# EasyEDA schematic schematic.json
TITLE: Sensor Pin Connector; REV: 1.0; Date: 2024-11-30; Sheet: 1/1; Drawn By: Jack Ruder; Company: Athenaeum Stade - AtheBlues
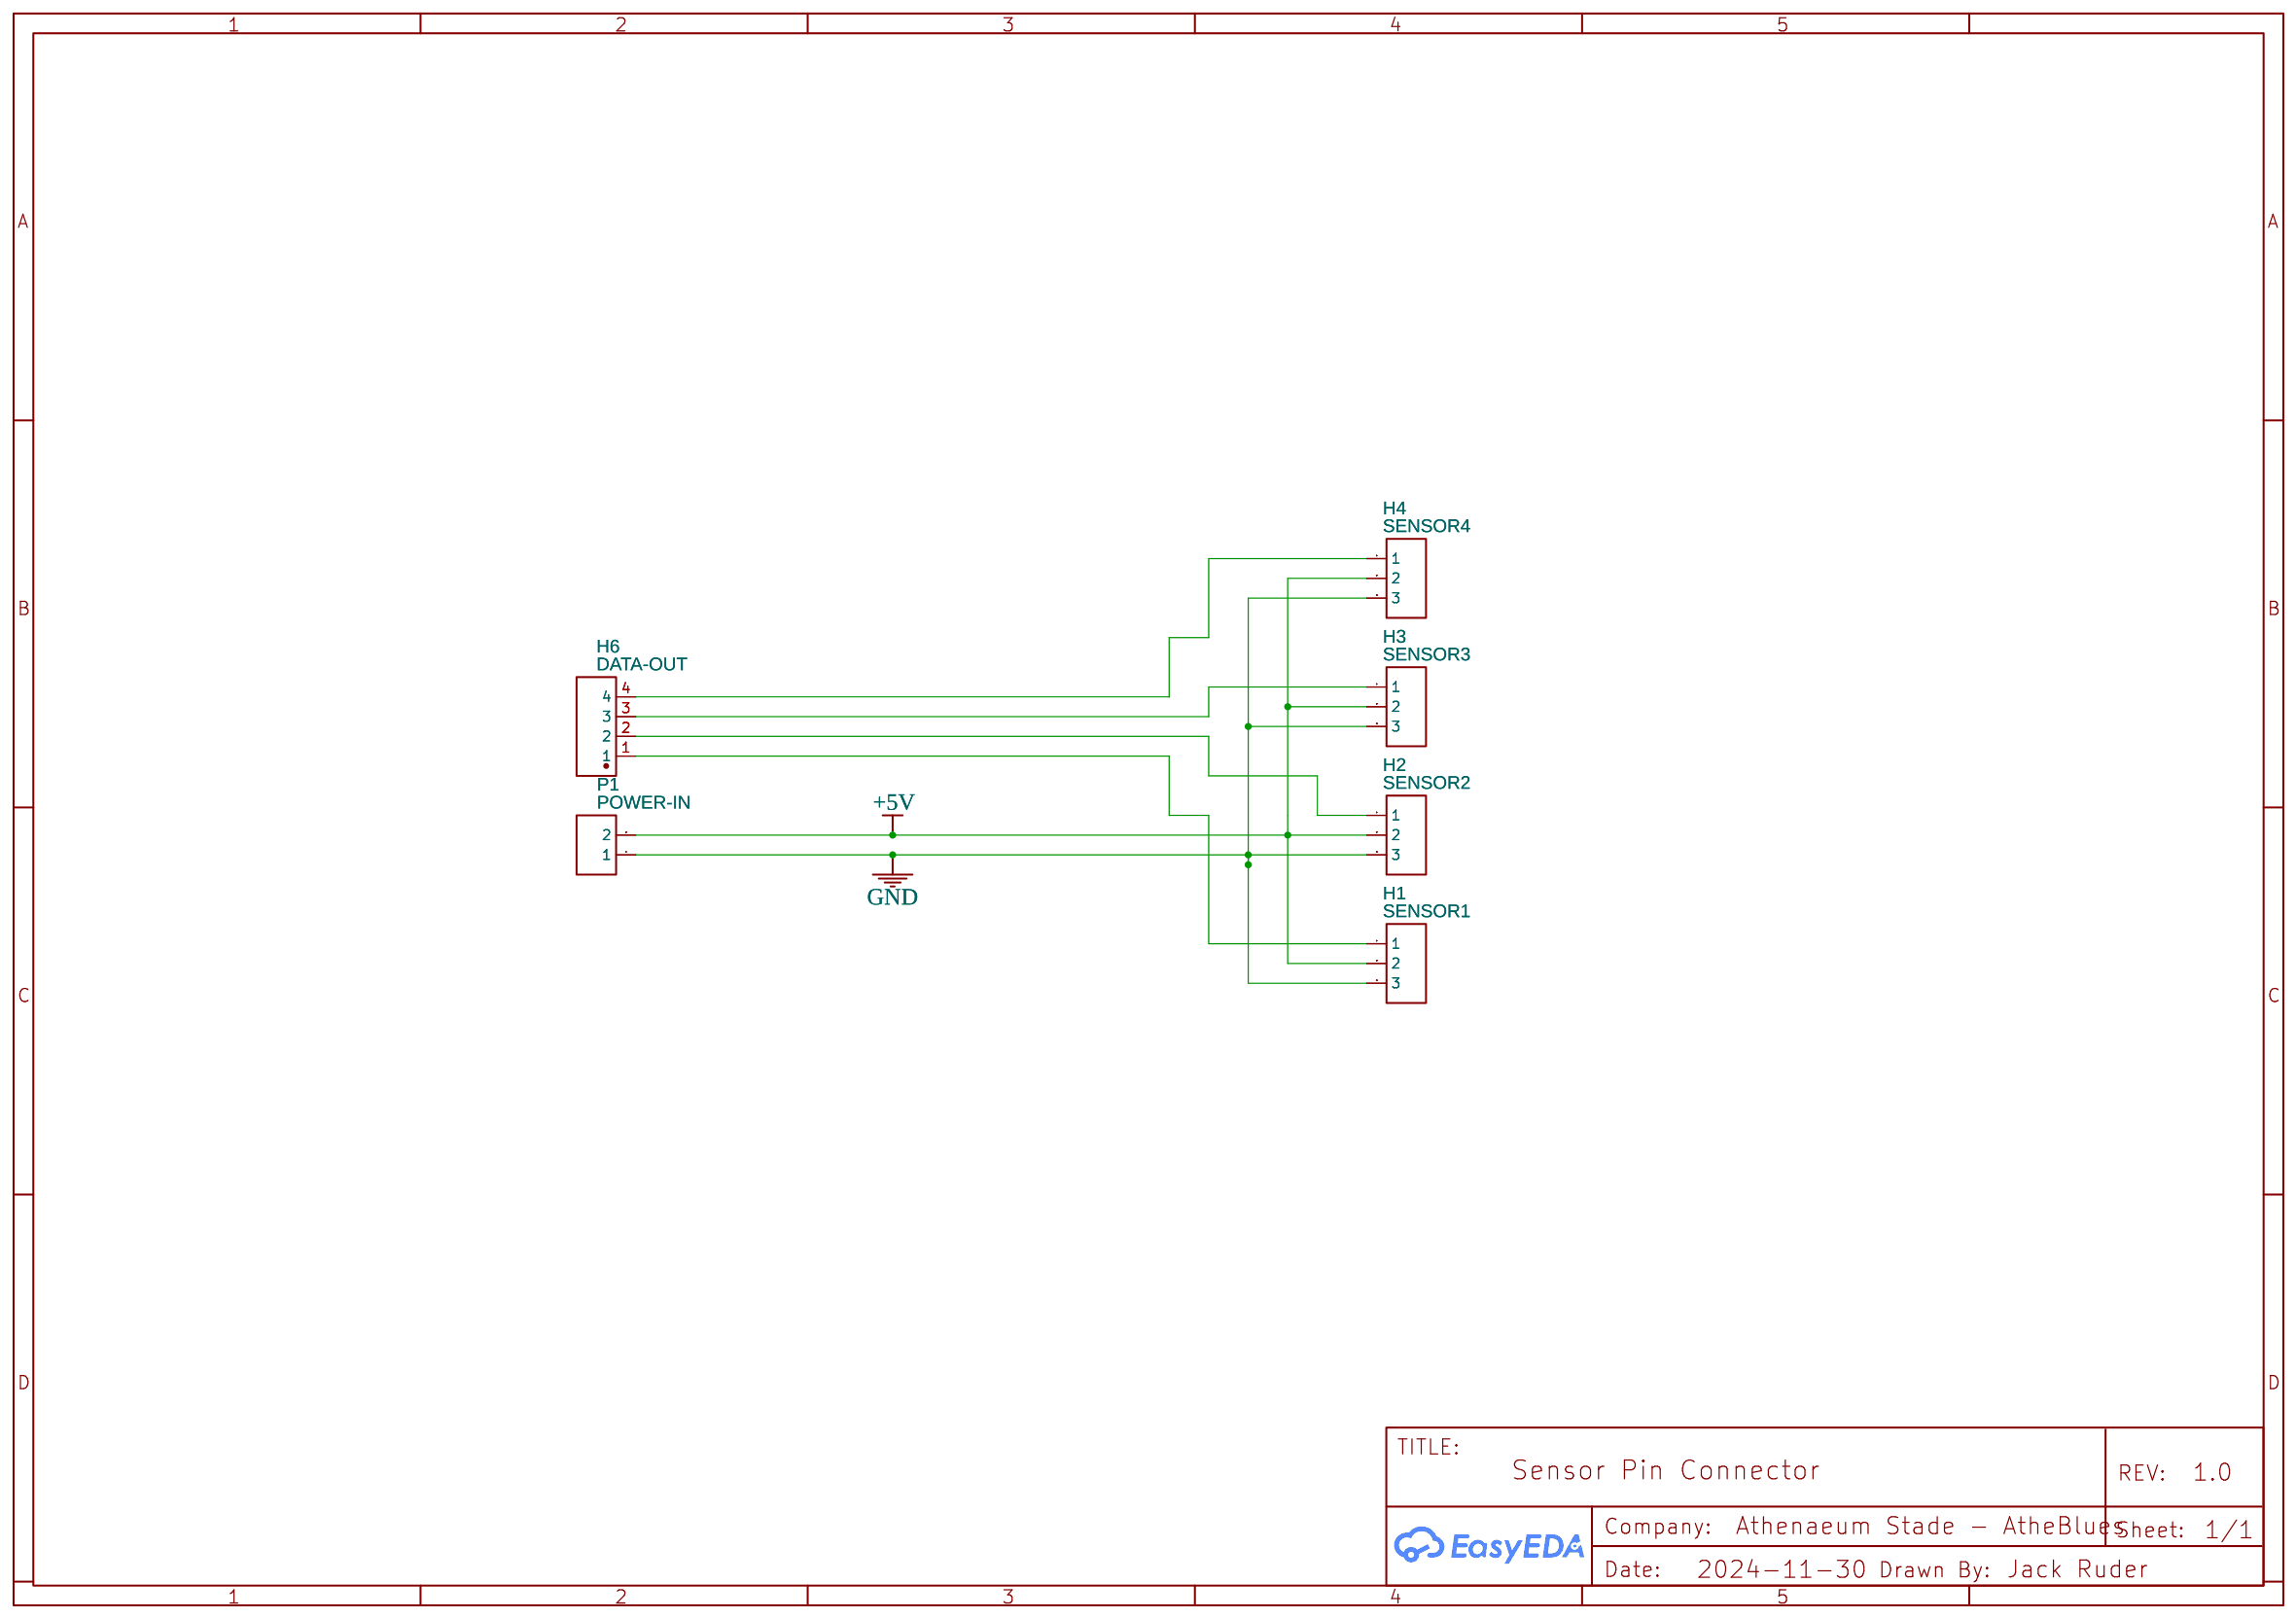
[diagram p0: schematic sheet]

## Parts
H1  SENSOR1  [HDR-TH_3P-P2.54-V-M-1]
H2  SENSOR2  [HDR-TH_3P-P2.54-V-M-1]
H3  SENSOR3  [HDR-TH_3P-P2.54-V-M-1]
H4  SENSOR4  [HDR-TH_3P-P2.54-V-M-1]
H6  DATA-OUT  [HDR-TH_4P-P2.54-V-F]
P1  POWER-IN  [HDR-TH_2P-P2.54-V-F]

## Library data of the parts
H1-H4 = Header-Male-2.54_1x3: Supplier: LCSC; Manufacturer: BOOMELE(博穆精密); Manufacturer Part: 2.54-1*3P针; Supplier Part: C49257; JLCPCB Part Class: Extended Part
H6 = PM254V-11-04-H85: Contributor: LCSC; Supplier: LCSC; Supplier Part: C541851; Manufacturer: XFCN(兴飞); JLCPCB Part Class: Extended Part
P1 = Header-Female-2.54_1x2: Supplier: LCSC; Manufacturer: BOOMELE(博穆精密); Manufacturer Part: 2.54-1*2P母; Supplier Part: C49661; JLCPCB Part Class: Extended Part

## Nets
+5V: H1.2 H2.2 H3.2 H4.2 P1.2
GND: H1.3 H2.3 H3.3 H4.3 P1.1
Net-(H1-1): H1.1 H6.1
Net-(H2-1): H2.1 H6.2
Net-(H3-1): H3.1 H6.3
Net-(H4-1): H4.1 H6.4
